# EAGLE schematic Pendeteksi_Kebusukan_Berbasis_IOT (EAGLE 9.6.1)
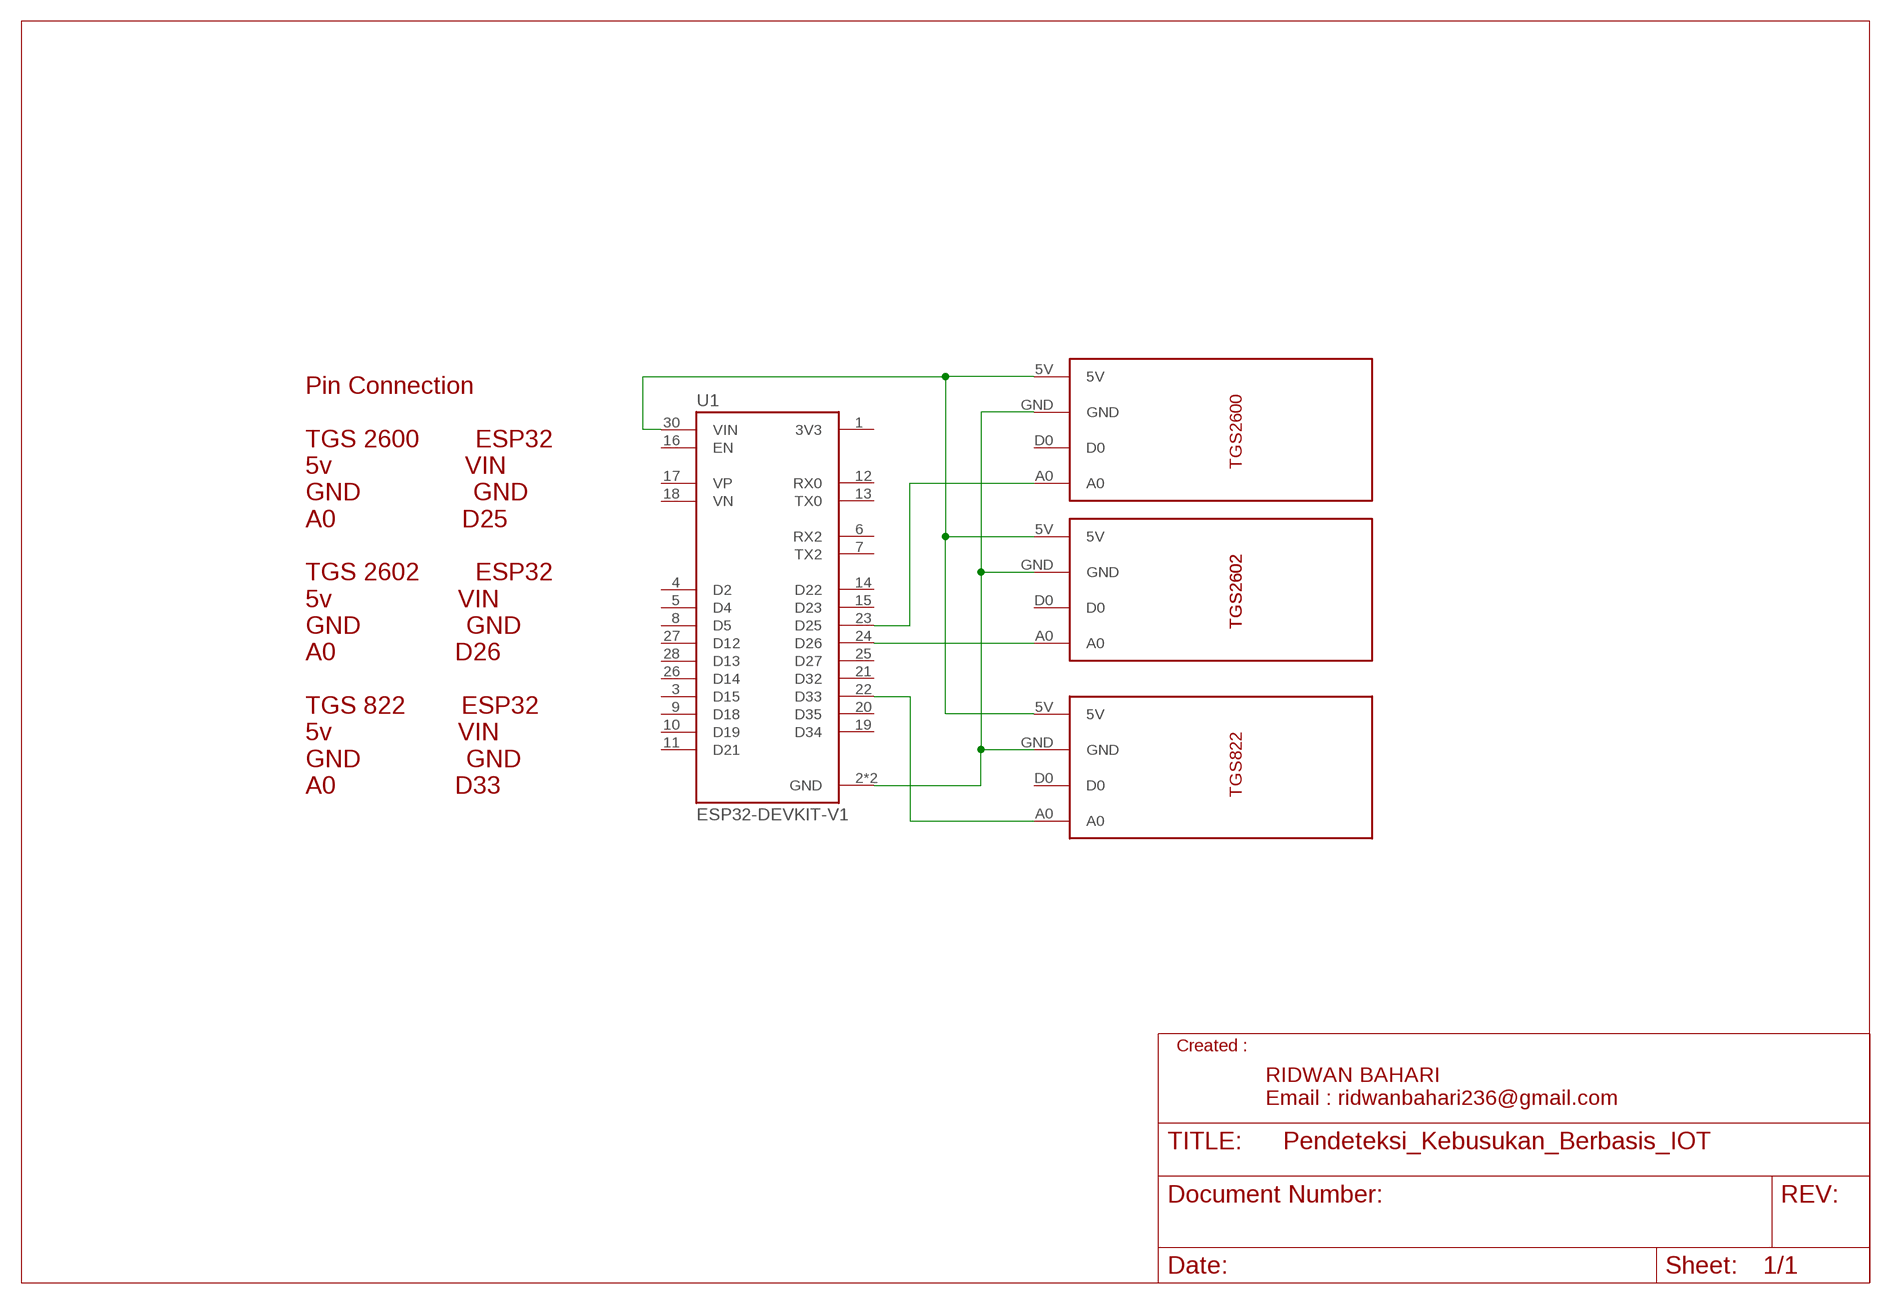
[diagram p0: schematic, sheet 1]

## Parts
SENSOR_GAS1  SENSOR_GAS  [SENSOR_GAS]
SENSOR_GAS2  SENSOR_GAS  [SENSOR_GAS]
SENSOR_GAS3  SENSOR_GAS  [SENSOR_GAS]
U1  ESP32-DEVKIT-V1  [MODULE_ESP32_DEVKIT_V1]

## Nets
N$1: SENSOR_GAS1.5V SENSOR_GAS2.5V SENSOR_GAS3.5V U1.30(VIN)
N$2: SENSOR_GAS1.GND SENSOR_GAS2.GND SENSOR_GAS3.GND U1.2(GND) U1.29(GND)
N$3: SENSOR_GAS1.A0 U1.23(D25)
N$5: SENSOR_GAS3.A0 U1.22(D33)
N$6: SENSOR_GAS2.A0 U1.24(D26)
Unconnected: SENSOR_GAS1.D0 SENSOR_GAS2.D0 SENSOR_GAS3.D0 U1.1(3V3) U1.3(D15) U1.4(D2) U1.5(D4) U1.6(RX2) U1.7(TX2) U1.8(D5) U1.9(D18) U1.10(D19) U1.11(D21) U1.12(RX0) U1.13(TX0) U1.14(D22) U1.15(D23) U1.16(EN) U1.17(VP) U1.18(VN) U1.19(D34) U1.20(D35) U1.21(D32) U1.25(D27) U1.26(D14) U1.27(D12) U1.28(D13)

## Notes on the sheet
- TGS2600
- TGS2602 | TGS2602
- TGS822
- Pin Connection
  
  TGS 2600        ESP32
  5v                   VIN
  GND                GND
  A0                  D25
  
  TGS 2602        ESP32
  5v                  VIN
  GND               GND
  A0                 D26
  
  TGS 822        ESP32
  5v                  VIN
  GND               GND
  A0                 D33
- Created :
- RIDWAN BAHARI
  Email : ridwanbahari236@gmail.com

## Library data of the parts
SENSOR_GAS1-SENSOR_GAS3 = GAS_SENS:SENSOR_GAS
U1 = ESP32-DEVKIT-V1:ESP32-DEVKIT-V1: Dual core, Wi-Fi: 2.4 GHz up to 150 Mbits/s,BLE (Bluetooth Low Energy) and legacy Bluetooth, 32 bits, Up to 240 MHz Check availability <https://pricing.snapeda.com/parts/ESP32-DEVKIT-V1/Do%20it/view-part?ref=eda>; AVAILABILITY: Not in stock; CHECK_PRICES: https://www.snapeda.com/parts/ESP32-DEVKIT-V1/Do+it/view-part/?ref=eda; DESCRIPTION: Dual core, Wi-Fi: 2.4 GHz up to 150 Mbits/s,BLE (Bluetooth Low Energy) and legacy Bluetooth, 32 bits, Up to 240 MHz; MF: Do it; MP: ESP32-DEVKIT-V1; PACKAGE: None; PRICE: None; SNAPEDA_LINK: https://www.snapeda.com/parts/ESP32-DEVKIT-V1/Do+it/view-part/?ref=snap